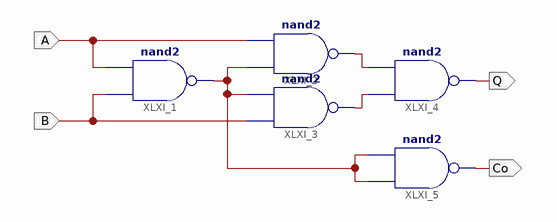
[diagram p0: schematic sheet 1]
// Xilinx ISE schematic Lab4_Ex3.sch (spartan3e) as structural Verilog: 5 symbols, 4 ports
module Lab4_Ex3 (
  input  A,
  input  B,
  output Q,
  output Co
);

  wire XLXN_12, XLXN_13, XLXN_22;

  nand XLXI_1 (XLXN_22, B, A);
  nand XLXI_2 (XLXN_12, XLXN_22, A);
  nand XLXI_3 (XLXN_13, B, XLXN_22);
  nand XLXI_4 (Q, XLXN_13, XLXN_12);
  nand XLXI_5 (Co, XLXN_22, XLXN_22);
endmodule
